# Altium schematic sheet Models.SchDoc
size A4
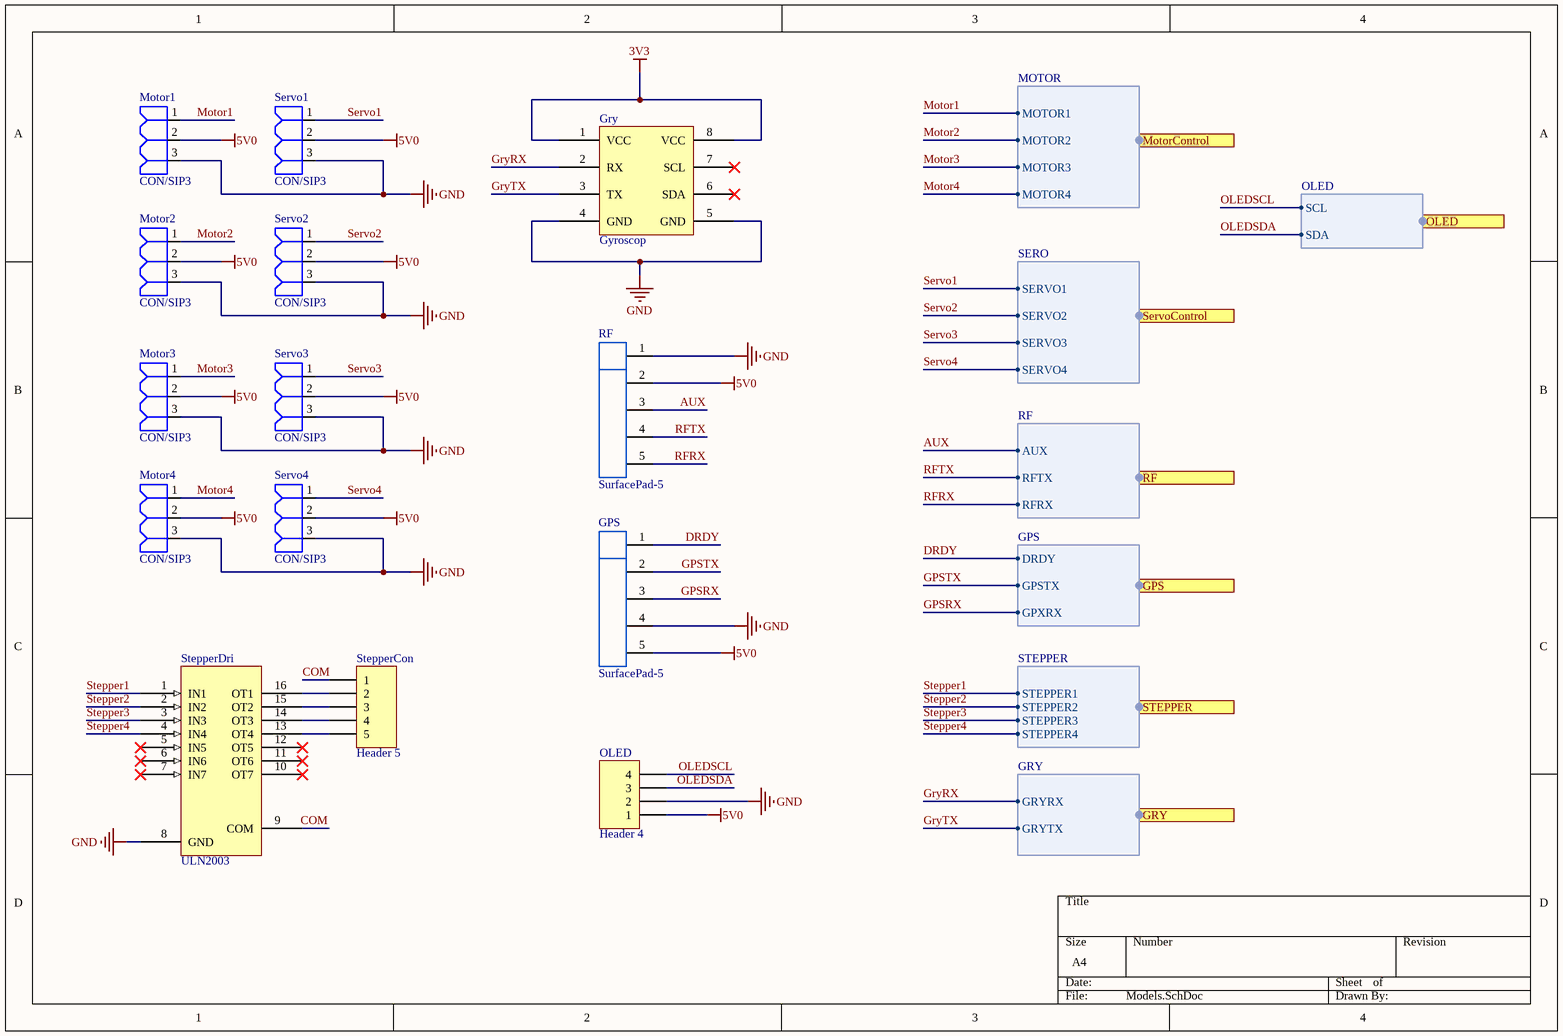
[diagram p0: Models.SchDoc]

## Parts
GPS  SurfacePad-5  [SurfacePad-5]
Gry  Gyroscop  [串口陀螺仪]
Motor1  CON/SIP3  [HDR1X3]
Motor2  CON/SIP3  [HDR1X3]
Motor3  CON/SIP3  [HDR1X3]
Motor4  CON/SIP3  [HDR1X3]
OLED  Header 4  [HDR1X4]
RF  SurfacePad-5  [SurfacePad-5]
Servo1  CON/SIP3  [HDR1X3]
Servo2  CON/SIP3  [HDR1X3]
Servo3  CON/SIP3  [HDR1X3]
Servo4  CON/SIP3  [HDR1X3]
StepperCon  Header 5  [HDR1X5]
StepperDri  ULN2003  [SOIC16]

## Ports
GPS (harness GPS), GRY (harness GRY), MotorControl (harness MOTOR), OLED (harness OLED), RF (harness RF), ServoControl (harness SERO), STEPPER (harness STEPPER)

## Harnesses
MOTOR: MOTOR1, MOTOR2, MOTOR3, MOTOR4
SERO: SERVO1, SERVO2, SERVO3, SERVO4
RF: AUX, RFTX, RFRX
GPS: DRDY, GPSTX, GPXRX
STEPPER: STEPPER1, STEPPER2, STEPPER3, STEPPER4
GRY: GRYRX, GRYTX
OLED: SCL, SDA

## Nets
3V3: Gry.1(VCC) Gry.8(VCC)
5V0: GPS.5 Motor1.2 Motor2.2 Motor3.2 Motor4.2 OLED.1 RF.2 Servo1.2 Servo2.2 Servo3.2 Servo4.2
GND: GPS.4 Gry.4(GND) Gry.5(GND) Motor1.3 Motor2.3 Motor3.3 Motor4.3 OLED.2 RF.1 Servo1.3 Servo2.3 Servo3.3 Servo4.3 StepperDri.8(GND)
AUX: RF.3 ; port RF.AUX
COM: StepperCon.1 StepperDri.9(COM)
DRDY: GPS.1 ; port GPS.DRDY
GPSRX: GPS.3 ; port GPS.GPXRX
GPSTX: GPS.2 ; port GPS.GPSTX
GryRX: Gry.2(RX) ; port GRY.GRYRX
GryTX: Gry.3(TX) ; port GRY.GRYTX
Motor1: Motor1.1 ; port MotorControl.MOTOR1
Motor2: Motor2.1 ; port MotorControl.MOTOR2
Motor3: Motor3.1 ; port MotorControl.MOTOR3
Motor4: Motor4.1 ; port MotorControl.MOTOR4
OLEDSCL: OLED.4 ; port OLED.SCL
OLEDSDA: OLED.3 ; port OLED.SDA
RFRX: RF.5 ; port RF.RFRX
RFTX: RF.4 ; port RF.RFTX
Servo1: Servo1.1 ; port ServoControl.SERVO1
Servo2: Servo2.1 ; port ServoControl.SERVO2
Servo3: Servo3.1 ; port ServoControl.SERVO3
Servo4: Servo4.1 ; port ServoControl.SERVO4
Stepper1: StepperDri.1(IN1) ; port STEPPER.STEPPER1
Stepper2: StepperDri.2(IN2) ; port STEPPER.STEPPER2
Stepper3: StepperDri.3(IN3) ; port STEPPER.STEPPER3
Stepper4: StepperDri.4(IN4) ; port STEPPER.STEPPER4
NetStepperCon_2: StepperCon.2 StepperDri.16(OT1)
NetStepperCon_3: StepperCon.3 StepperDri.15(OT2)
NetStepperCon_4: StepperCon.4 StepperDri.14(OT3)
NetStepperCon_5: StepperCon.5 StepperDri.13(OT4)

Not connected (* = marked no-connect by the designer): Gry 6(SDA)* 7(SCL)*; StepperDri 5(IN5)* 6(IN6)* 7(IN7)* 10(OT7)* 11(OT6)* 12(OT5)*

## Library data of the parts
Gry = 串口陀螺仪
OLED = Header 4: Header, 4-Pin; LatestRevisionDate: 17-Jul-2002; LatestRevisionNote: Re-released for DXP Platform.; Publisher: Altium Limited
StepperCon = Header 5: Header, 5-Pin; LatestRevisionDate: 17-Jul-2002; LatestRevisionNote: Re-released for DXP Platform.; Publisher: Altium Limited
StepperDri = ULN2003: 驱动IC